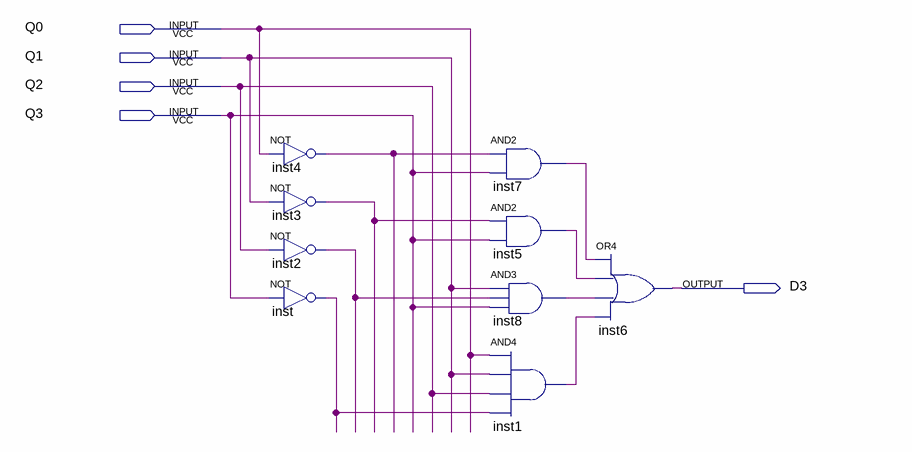
[diagram p0: schematic sheet]
// Quartus schematic D3.bdf as structural Verilog: 9 symbols, 5 pins
module D3 (
  input  Q0,
  input  Q1,
  input  Q2,
  input  Q3,
  output D3
);

  wire inst1_out, inst2_out, inst3_out, inst4_out, inst5_out, inst7_out, inst8_out, inst_out;

  not inst4 (inst4_out, Q0);
  not inst3 (inst3_out, Q1);
  not inst2 (inst2_out, Q2);
  not inst (inst_out, Q3);
  and inst7 (inst7_out, inst4_out, Q3);
  and inst5 (inst5_out, inst3_out, Q3);
  and inst8 (inst8_out, Q1, inst2_out, Q3);
  and inst1 (inst1_out, Q0, Q1, Q2, inst_out);
  or inst6 (D3, inst7_out, inst5_out, inst8_out, inst1_out);
endmodule
